# Altium project AD7175.PrjPcb
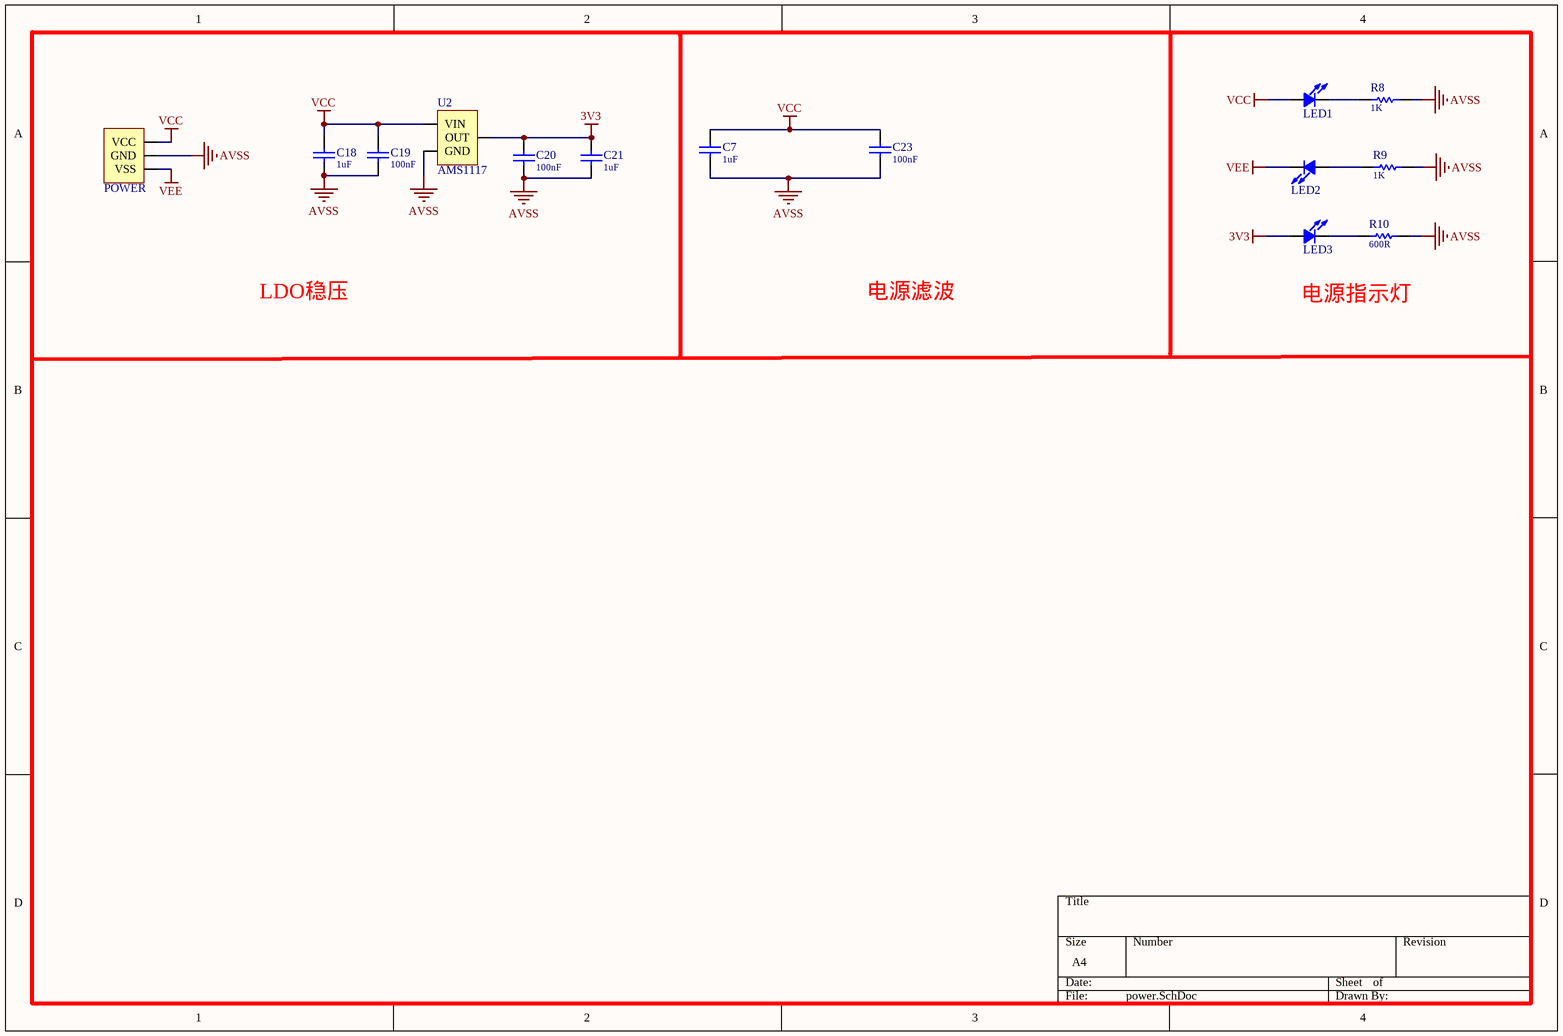
[diagram p0: power.SchDoc]
5 sheets, 97 parts. Net scope: global (net labels, ports and power ports of the same name join across sheets).
Board file: AD7175.PcbDoc
Sheets:
  power.SchDoc
  core.SchDoc
  reference.SchDoc
  filter.SchDoc
  fda.SchDoc

## Sheet power.SchDoc
size A4

### Parts
C7  value 1uF  [C0603-L]  (hidden comment: Cap-S)
C18  value 1uF  [C0603-L]  (hidden comment: Cap-S)
C19  value 100nF  [C0603-L]  (hidden comment: Cap-S)
C20  value 100nF  [C0603-L]  (hidden comment: Cap-S)
C21  value 1uF  [C0603-L]  (hidden comment: Cap-S)
C23  value 100nF  [C0603-L]  (hidden comment: Cap-S)
LED1  LED  [Led-0805_L]  (value not drawn)
LED2  LED  [Led-0805_L]  (value not drawn)
LED3  LED  [Led-0805_L]  (value not drawn)
POWER  Power-3P  [SIPA03]  (value not drawn)
R8  value 1K  [R0603-L]  (hidden comment: R)
R9  value 1K  [R0603-L]  (hidden comment: R)
R10  value 600R  [R0603-L]  (hidden comment: R)
U2  AMS1117  [SOT-223]

### Nets
3V3: C20.2 C21.2 LED3.1 U2.2(OUT)
AVSS: C7.2 C18.1 C19.1 C20.1 C21.1 C23.2 POWER.2(GND) R8.2 R9.2 R10.2 U2.1(GND)
VCC: C7.1 C18.2 C19.2 C23.1 LED1.1 POWER.1(VCC) U2.3(VIN)
VEE: LED2.2 POWER.3(VSS)
NetLED1_2: LED1.2 R8.1
NetLED2_1: LED2.1 R9.1
NetLED3_2: LED3.2 R10.1

### Notes on the sheet
- LDO稳压
- 电源滤波
- 电源指示灯

### Library data of the parts
C7 C18-C21 C23 = Cap-S: 贴片瓷片电容
LED1-LED3 = LED: 发光二极管
POWER = Power-3P: 供电端子
R8-R10 = Res: 贴片电阻

## Sheet core.SchDoc
size A4
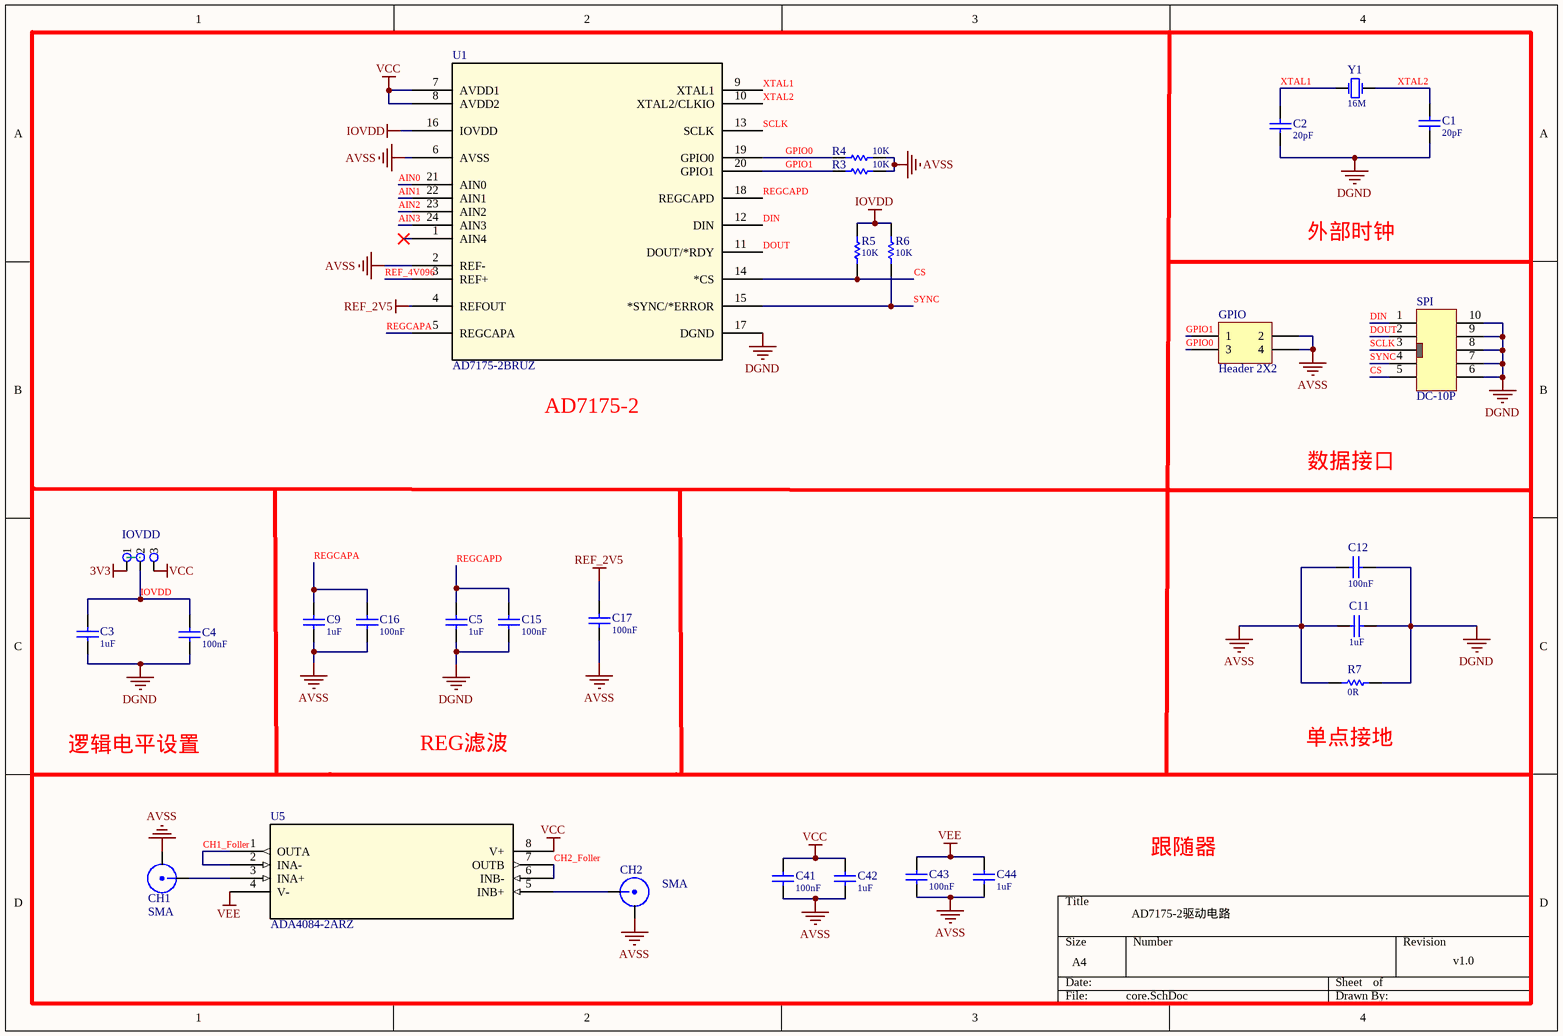
[diagram p1: core.SchDoc]

### Parts
C1  value 20pF  [C0603-L]  (hidden comment: Cap-S)
C2  value 20pF  [C0603-L]  (hidden comment: Cap-S)
C3  value 1uF  [C0603-L]  (hidden comment: Cap-S)
C4  value 100nF  [C0603-L]  (hidden comment: Cap-S)
C5  value 1uF  [C0603-L]  (hidden comment: Cap-S)
C9  value 1uF  [C0603-L]  (hidden comment: Cap-S)
C11  value 1uF  [C0603-L]  (hidden comment: Cap-S)
C12  value 100nF  [C0603-L]  (hidden comment: Cap-S)
C15  value 100nF  [C0603-L]  (hidden comment: Cap-S)
C16  value 100nF  [C0603-L]  (hidden comment: Cap-S)
C17  value 100nF  [C0603-L]  (hidden comment: Cap-S)
C41  value 100nF  [C0603-L]  (hidden comment: Cap-S)
C42  value 1uF  [C0603-L]  (hidden comment: Cap-S)
C43  value 100nF  [C0603-L]  (hidden comment: Cap-S)
C44  value 1uF  [C0603-L]  (hidden comment: Cap-S)
CH1  SMA  [SMA1]
CH2  SMA  [SMA1]
GPIO  Header 2X2  [HDR2X2]
IOVDD  Jumper  [JUMPER1x3]  (value not drawn)
R3  value 10K  [R0603-L]  (hidden comment: R)
R4  value 10K  [R0603-L]  (hidden comment: R)
R5  value 10K  [R0603-L]  (hidden comment: R)
R6  value 10K  [R0603-L]  (hidden comment: R)
R7  value 0R  [R0603-L]  (hidden comment: R)
SPI  DC-10P  [DC-10P]
U1  AD7175-2BRUZ  [RU_24_ADI]
U5  ADA4084-2ARZ  [R_8_ADI]
Y1  value 16M  [XTAL-PB2-DIP]  (hidden comment: XTAL)

### Nets
3V3: IOVDD.1
AVSS: C9.1 C11.2 C12.2 C16.1 C17.1 C41.1 C42.1 C43.1 C44.1 CH1.2 CH2.2 GPIO.2 GPIO.4 R3.1 R4.1 R7.1 U1.2(REF-) U1.6(AVSS)
DGND: C1.2 C2.2 C3.1 C4.1 C5.1 C11.1 C12.1 C15.1 R7.2 SPI.6 SPI.7 SPI.8 SPI.9 SPI.10 U1.17(DGND)
IOVDD: C3.2 C4.2 IOVDD.2 R5.2 R6.2 U1.16(IOVDD)
REF_2V5: C17.2 U1.4(REFOUT)
REF_4V096: U1.3(REF+)
VCC: C41.2 C42.2 IOVDD.3 U1.7(AVDD1) U1.8(AVDD2) U5.8(V+)
VEE: C43.2 C44.2 U5.4(V-)
AIN0: U1.21(AIN0)
AIN1: U1.22(AIN1)
AIN2: U1.23(AIN2)
AIN3: U1.24(AIN3)
CH1_Foller: U5.1(OUTA) U5.2(INA-)
CH2_Foller: U5.6(INB-) U5.7(OUTB)
CS: R5.1 SPI.5 U1.14(*CS)
DIN: SPI.1 U1.12(DIN)
DOUT: SPI.2 U1.11(DOUT/*RDY)
GPIO0: GPIO.3 R4.2 U1.19(GPIO0)
GPIO1: GPIO.1 R3.2 U1.20(GPIO1)
REGCAPA: C9.2 C16.2 U1.5(REGCAPA)
REGCAPD: C5.2 C15.2 U1.18(REGCAPD)
SCLK: SPI.3 U1.13(SCLK)
SYNC: R6.1 SPI.4 U1.15(*SYNC/*ERROR)
XTAL1: C2.1 U1.9(XTAL1) Y1.1(OSC1)
XTAL2: C1.1 U1.10(XTAL2/CLKIO) Y1.2(OSC2)
NetCH1_1: CH1.1 U5.3(INA+)
NetCH2_1: CH2.1 U5.5(INB+)

Not connected (* = marked no-connect by the designer): U1 1(AIN4)*

### Notes on the sheet
- 外部时钟
- AD7175-2
- 数据接口
- 逻辑电平设置
- REG滤波
- (near R7) 单点接地
- 跟随器
- AD7175-2驱动电路
- v1.0

### Library data of the parts
C1-C5 C9 C11 C12 C15-C17 C41-C44 = Cap-S: 贴片瓷片电容
GPIO = Header 2X2: Header, 2-Pin, Dual row; LatestRevisionDate: 17-Jul-2002; LatestRevisionNote: Re-released for DXP Platform.; Publisher: Altium Limited
IOVDD = Jumper1*3
R3-R7 = Res: 贴片电阻
U1 = AD7175-2BRUZ: No Description Available; Mfr_Name: Analog Devices Inc; Copyright: Copyright (C) 2021 Ultra Librarian. All rights reserved.; Manufacturer_Part_Number: AD7175-2BRUZ; RefDes: RefDes; Type: DEV
U5 = ADA4084-2ARZ: No Description Available; Mfr_Name: Analog Devices Inc; Copyright: Copyright (C) 2021 Ultra Librarian. All rights reserved.; Manufacturer_Part_Number: ADA4084-2ARZ; RefDes: RefDes; Type: DEV
Y1 = XTAL: 晶振

## Sheet reference.SchDoc
size A4
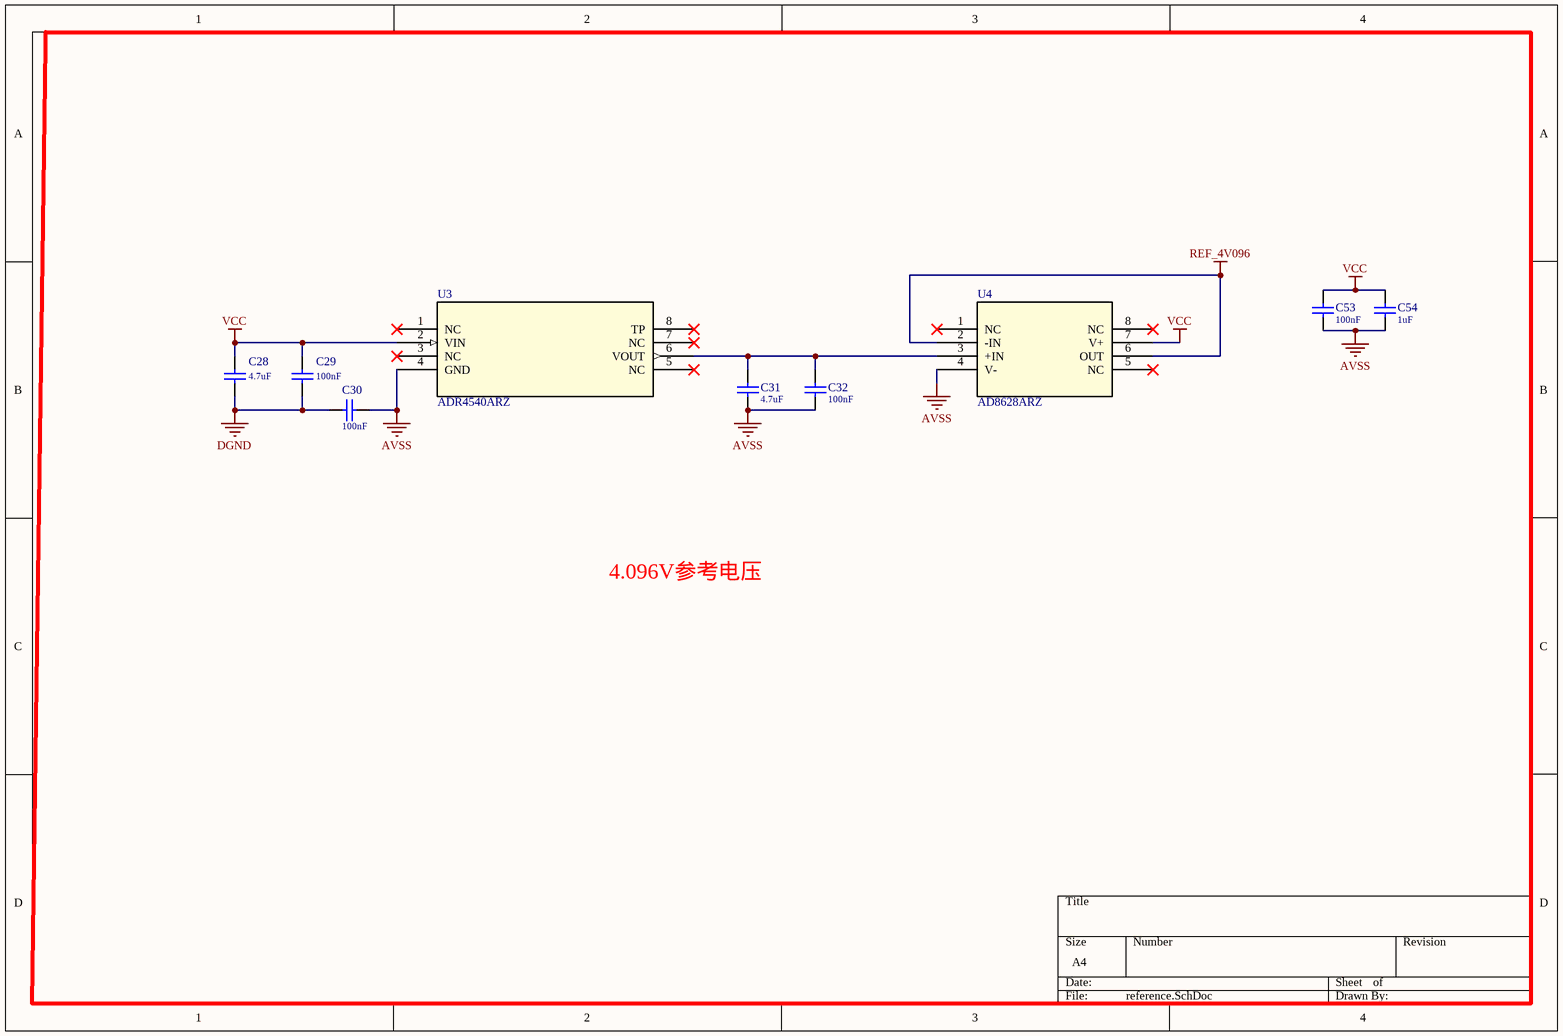
[diagram p2: reference.SchDoc]

### Parts
C28  value 4.7uF  [C0603-L]  (hidden comment: Cap-S)
C29  value 100nF  [C0603-L]  (hidden comment: Cap-S)
C30  value 100nF  [C0603-L]  (hidden comment: Cap-S)
C31  value 4.7uF  [C0603-L]  (hidden comment: Cap-S)
C32  value 100nF  [C0603-L]  (hidden comment: Cap-S)
C53  value 100nF  [C0603-L]  (hidden comment: Cap-S)
C54  value 1uF  [C0603-L]  (hidden comment: Cap-S)
U3  ADR4540ARZ  [R_8_ADI]
U4  AD8628ARZ  [R_8_ADI]

### Nets
AVSS: C30.1 C31.1 C32.1 C53.1 C54.1 U3.4(GND) U4.4(V-)
DGND: C28.1 C29.1 C30.2
REF_4V096: U4.2(-IN) U4.6(OUT)
VCC: C28.2 C29.2 C53.2 C54.2 U3.2(VIN) U4.7(V+)
NetC31_2: C31.2 C32.2 U3.6(VOUT) U4.3(+IN)

Not connected (* = marked no-connect by the designer): U3 1(NC)* 3(NC)* 5(NC)* 7(NC)* 8(TP)*; U4 1(NC)* 5(NC)* 8(NC)*

### Notes on the sheet
- 4.096V参考电压

### Library data of the parts
C28-C32 C53 C54 = Cap-S: 贴片瓷片电容
U3 = ADR4540ARZ: No Description Available; Mfr_Name: Analog Devices Inc; Copyright: Copyright (C) 2021 Ultra Librarian. All rights reserved.; Manufacturer_Part_Number: ADR4540ARZ; RefDes: RefDes; Type: DEV
U4 = AD8628ARZ: No Description Available; Mfr_Name: Analog Devices Inc; Copyright: Copyright (C) 2021 Ultra Librarian. All rights reserved.; Manufacturer_Part_Number: AD8628ARZ; RefDes: RefDes; Type: DEV

## Sheet filter.SchDoc
size A4
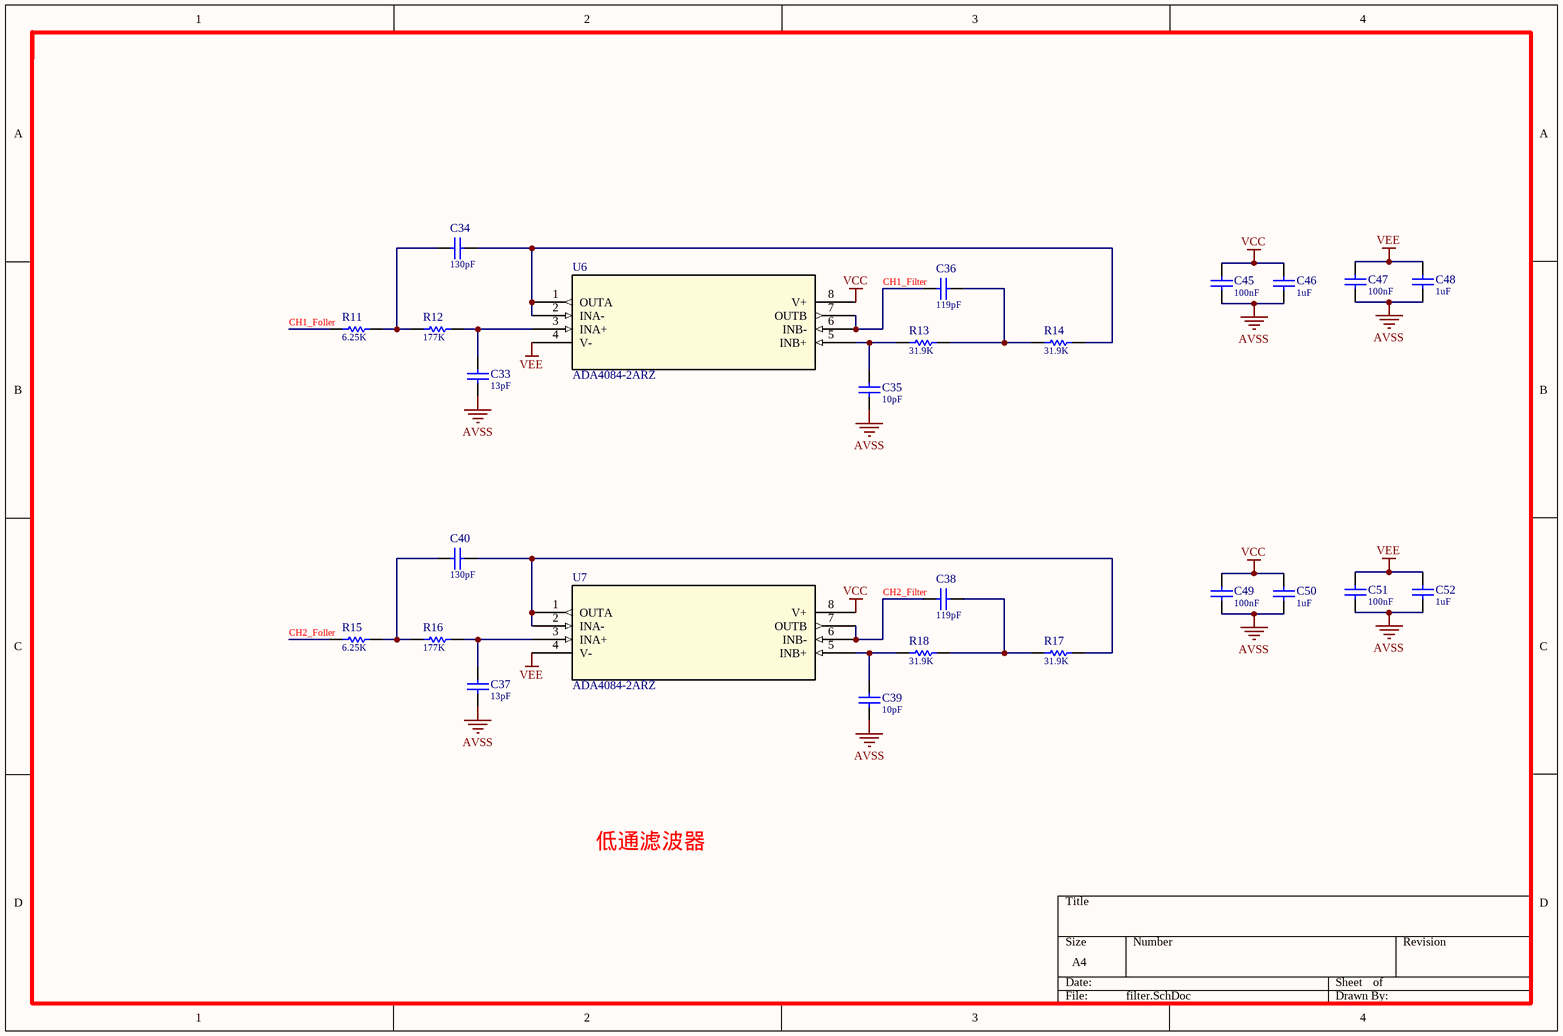
[diagram p3: filter.SchDoc]

### Parts
C33  value 13pF  [C0603-L]  (hidden comment: Cap-S)
C34  value 130pF  [C0603-L]  (hidden comment: Cap-S)
C35  value 10pF  [C0603-L]  (hidden comment: Cap-S)
C36  value 119pF  [C0603-L]  (hidden comment: Cap-S)
C37  value 13pF  [C0603-L]  (hidden comment: Cap-S)
C38  value 119pF  [C0603-L]  (hidden comment: Cap-S)
C39  value 10pF  [C0603-L]  (hidden comment: Cap-S)
C40  value 130pF  [C0603-L]  (hidden comment: Cap-S)
C45  value 100nF  [C0603-L]  (hidden comment: Cap-S)
C46  value 1uF  [C0603-L]  (hidden comment: Cap-S)
C47  value 100nF  [C0603-L]  (hidden comment: Cap-S)
C48  value 1uF  [C0603-L]  (hidden comment: Cap-S)
C49  value 100nF  [C0603-L]  (hidden comment: Cap-S)
C50  value 1uF  [C0603-L]  (hidden comment: Cap-S)
C51  value 100nF  [C0603-L]  (hidden comment: Cap-S)
C52  value 1uF  [C0603-L]  (hidden comment: Cap-S)
R11  value 6.25K  [R0603-L]  (hidden comment: R)
R12  value 177K  [R0603-L]  (hidden comment: R)
R13  value 31.9K  [R0603-L]  (hidden comment: R)
R14  value 31.9K  [R0603-L]  (hidden comment: R)
R15  value 6.25K  [R0603-L]  (hidden comment: R)
R16  value 177K  [R0603-L]  (hidden comment: R)
R17  value 31.9K  [R0603-L]  (hidden comment: R)
R18  value 31.9K  [R0603-L]  (hidden comment: R)
U6  ADA4084-2ARZ  [R_8_ADI]
U7  ADA4084-2ARZ  [R_8_ADI]

### Nets
AVSS: C33.1 C35.1 C37.1 C39.1 C45.1 C46.1 C47.1 C48.1 C49.1 C50.1 C51.1 C52.1
VCC: C45.2 C46.2 C49.2 C50.2 U6.8(V+) U7.8(V+)
VEE: C47.2 C48.2 C51.2 C52.2 U6.4(V-) U7.4(V-)
CH1_Filter: C36.2 U6.6(INB-) U6.7(OUTB)
CH1_Foller: R11.1
CH2_Filter: C38.2 U7.6(INB-) U7.7(OUTB)
CH2_Foller: R15.1
NetC33_2: C33.2 R12.2 U6.3(INA+)
NetC34_1: C34.1 R11.2 R12.1
NetC34_2: C34.2 R14.2 U6.1(OUTA) U6.2(INA-)
NetC35_2: C35.2 R13.1 U6.5(INB+)
NetC36_1: C36.1 R13.2 R14.1
NetC37_2: C37.2 R16.2 U7.3(INA+)
NetC38_1: C38.1 R17.1 R18.2
NetC39_2: C39.2 R18.1 U7.5(INB+)
NetC40_1: C40.1 R15.2 R16.1
NetC40_2: C40.2 R17.2 U7.1(OUTA) U7.2(INA-)

### Notes on the sheet
- 低通滤波器

### Library data of the parts
C33-C40 C45-C52 = Cap-S: 贴片瓷片电容
R11-R18 = Res: 贴片电阻
U6 U7 = ADA4084-2ARZ: as U5 on sheet core; Copyright: Copyright (C) 2021 Ultra Librarian. All rights reserved.; Manufacturer_Part_Number: ADA4084-2ARZ; RefDes: RefDes; Type: DEV

## Sheet fda.SchDoc
size A4
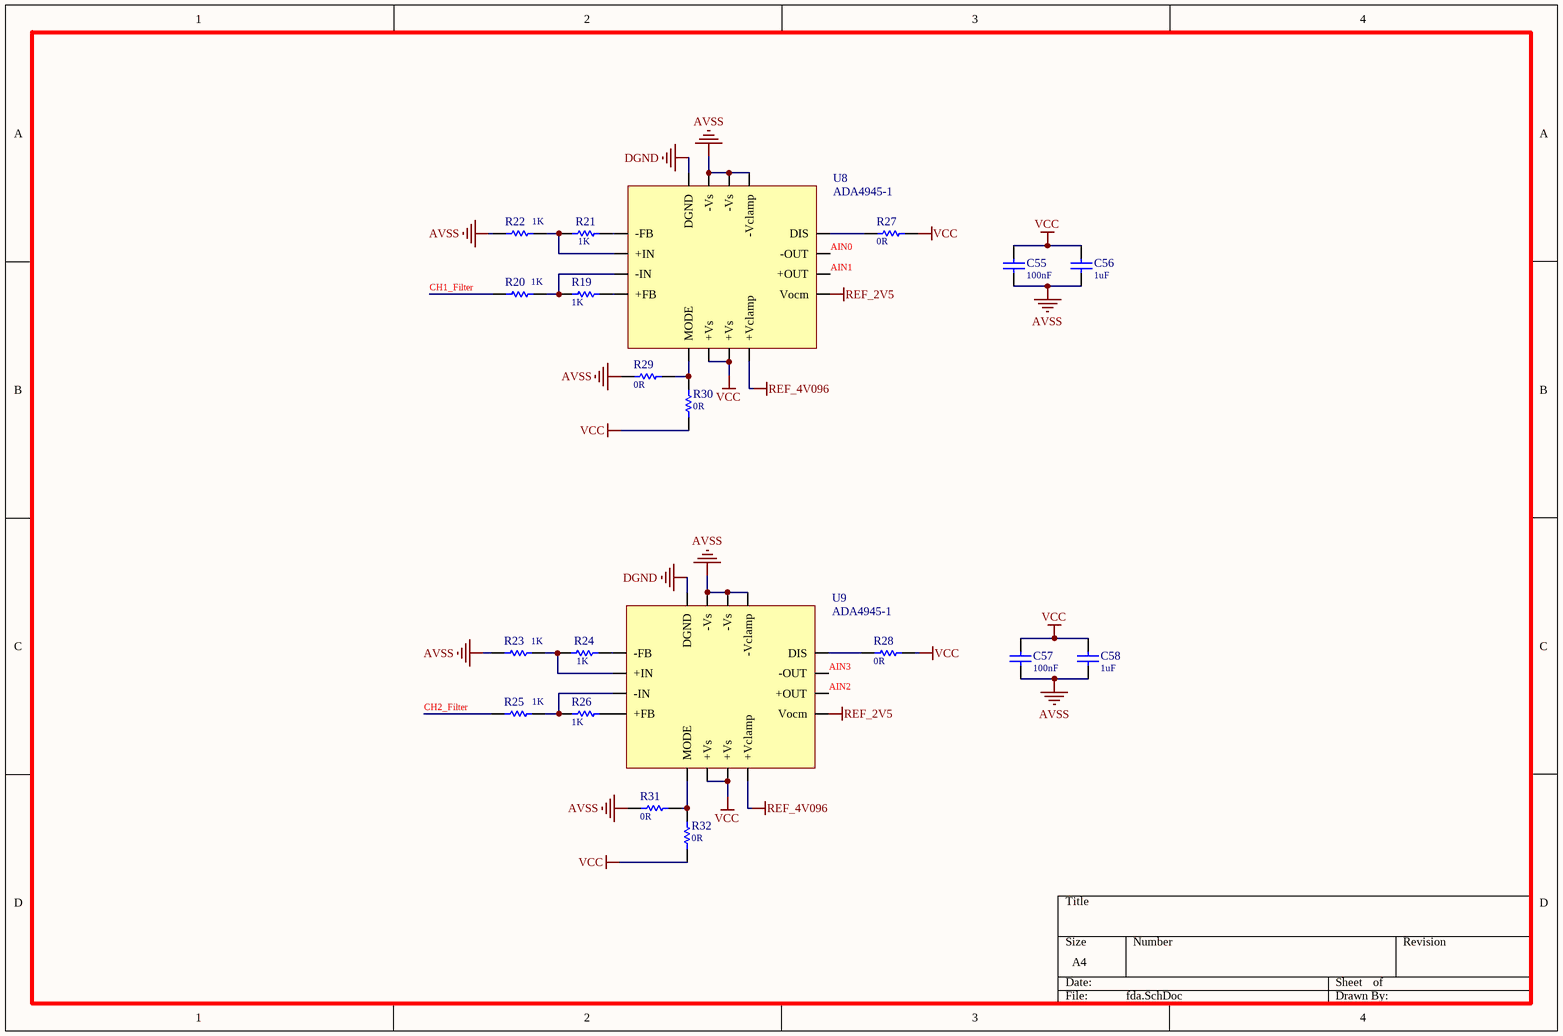
[diagram p4: fda.SchDoc]

### Parts
C55  value 100nF  [C0603-L]  (hidden comment: Cap-S)
C56  value 1uF  [C0603-L]  (hidden comment: Cap-S)
C57  value 100nF  [C0603-L]  (hidden comment: Cap-S)
C58  value 1uF  [C0603-L]  (hidden comment: Cap-S)
R19  value 1K  [R0603-L]  (hidden comment: R)
R20  value 1K  [R0603-L]  (hidden comment: R)
R21  value 1K  [R0603-L]  (hidden comment: R)
R22  value 1K  [R0603-L]  (hidden comment: R)
R23  value 1K  [R0603-L]  (hidden comment: R)
R24  value 1K  [R0603-L]  (hidden comment: R)
R25  value 1K  [R0603-L]  (hidden comment: R)
R26  value 1K  [R0603-L]  (hidden comment: R)
R27  value 0R  [R0603-L]  (hidden comment: R)
R28  value 0R  [R0603-L]  (hidden comment: R)
R29  value 0R  [R0603-L]  (hidden comment: R)
R30  value 0R  [R0603-L]  (hidden comment: R)
R31  value 0R  [R0603-L]  (hidden comment: R)
R32  value 0R  [R0603-L]  (hidden comment: R)
U8  ADA4945-1  [CP_16_22]
U9  ADA4945-1  [CP_16_22]

### Nets
AVSS: C55.1 C56.1 C57.1 C58.1 R22.1 R23.1 R29.2 R31.2 U8.13(-Vclamp) U8.14(-Vs) U8.15(-Vs) U9.13(-Vclamp) U9.14(-Vs) U9.15(-Vs)
DGND: U8.16(DGND) U9.16(DGND)
REF_2V5: U8.9(Vocm) U9.9(Vocm)
REF_4V096: U8.8(+Vclamp) U9.8(+Vclamp)
VCC: C55.2 C56.2 C57.2 C58.2 R27.2 R28.2 R30.2 R32.2 U8.6(+Vs) U8.7(+Vs) U9.6(+Vs) U9.7(+Vs)
AIN0: U8.11(-OUT)
AIN1: U8.10(+OUT)
AIN2: U9.10(+OUT)
AIN3: U9.11(-OUT)
CH1_Filter: R20.1
CH2_Filter: R25.1
NetR19_1: R19.1 R20.2 U8.3(-IN)
NetR19_2: R19.2 U8.4(+FB)
NetR21_1: R21.1 R22.2 U8.2(+IN)
NetR21_2: R21.2 U8.1(-FB)
NetR23_2: R23.2 R24.1 U9.2(+IN)
NetR24_2: R24.2 U9.1(-FB)
NetR25_2: R25.2 R26.1 U9.3(-IN)
NetR26_2: R26.2 U9.4(+FB)
NetR27_1: R27.1 U8.12(DIS)
NetR28_1: R28.1 U9.12(DIS)
NetR29_1: R29.1 R30.1 U8.5(MODE)
NetR31_1: R31.1 R32.1 U9.5(MODE)

### Library data of the parts
C55-C58 = Cap-S: 贴片瓷片电容
R19-R32 = Res: 贴片电阻

## Nets that join several sheets
3V3: power (C20.2 C21.2 LED3.1 U2.2), core (IOVDD.1)
AVSS: power (11 pins), core (18 pins), reference (7 pins), filter (12 pins), fda (14 pins)
DGND: core (15 pins), reference (C28.1 C29.1 C30.2), fda (U8.16 U9.16)
REF_2V5: core (C17.2 U1.4), fda (U8.9 U9.9)
REF_4V096: core (U1.3), reference (U4.2 U4.6), fda (U8.8 U9.8)
VCC: power (7 pins), core (6 pins), reference (6 pins), filter (6 pins), fda (12 pins)
VEE: power (LED2.2 POWER.3), core (C43.2 C44.2 U5.4), filter (6 pins)
AIN0: core (U1.21), fda (U8.11)
AIN1: core (U1.22), fda (U8.10)
AIN2: core (U1.23), fda (U9.10)
AIN3: core (U1.24), fda (U9.11)
CH1_Filter: filter (C36.2 U6.6 U6.7), fda (R20.1)
CH1_Foller: core (U5.1 U5.2), filter (R11.1)
CH2_Filter: filter (C38.2 U7.6 U7.7), fda (R25.1)
CH2_Foller: core (U5.6 U5.7), filter (R15.1)